# Altium schematic sheet Connectors.SchDoc
size A4; SheetNumber: 1; SheetTotal: 7
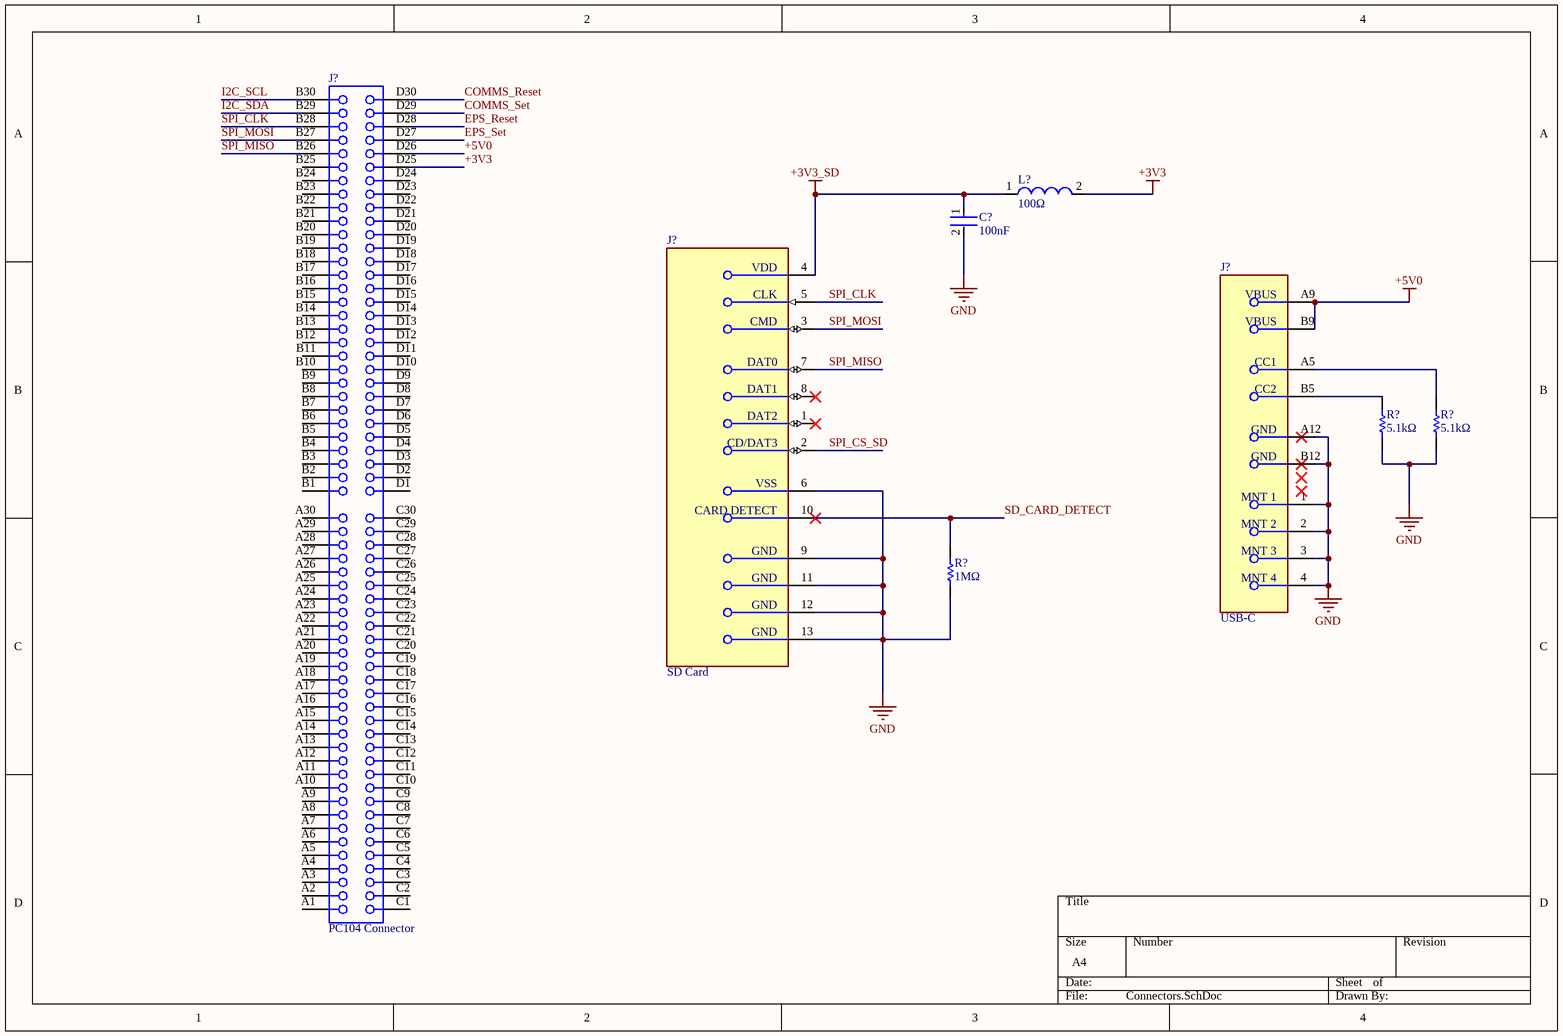
[diagram p0: Connectors.SchDoc]

## Parts
(Parts that share a designator on the sheet are numbered #1, #2 ... from top to bottom, then left to right.)
C?  100nF  [FP-CGA3E-0_3-0_1-IPC_A]
J?#1  SD Card  [FP-DM3CS-SF-MFG]
J?#2  USB-C  [FP-USB4125-GF-A-0190-MFG]
J?#3  PC104 Connector  [BTB2-V120F-04]
L?  100Ω  [SMD-0402]
R?#1  5.1kΩ  [RESC0603X26X15NL03T05]
R?#2  5.1kΩ  [RESC0603X26X15NL03T05]
R?#3  1MΩ  [RESC1005X40X25NL05T10]

## Nets
+3V3: J?#3.D25 L?.2
+3V3_SD: C?.1 J?#1.4(VDD) L?.1
+5V0: J?#2.A9(VBUS) J?#2.B9(VBUS) J?#3.D26
GND: C?.2 J?#1.6(VSS) J?#1.9(GND) J?#1.11(GND) J?#1.12(GND) J?#1.13(GND) J?#2.1(MNT_1) J?#2.2(MNT_2) J?#2.3(MNT_3) J?#2.4(MNT_4) J?#2.A12(GND) J?#2.B12(GND) R?#1.1 R?#2.1 R?#3.2
COMMS_Reset: J?#3.D30
COMMS_Set: J?#3.D29
EPS_Reset: J?#3.D28
EPS_Set: J?#3.D27
I2C_SCL: J?#3.B30
I2C_SDA: J?#3.B29
SD_CARD_DETECT: J?#1.10(CARD_DETECT) R?#3.1
SPI_CLK: J?#1.5(CLK) J?#3.B28
SPI_CS_SD: J?#1.2(CD/DAT3)
SPI_MISO: J?#1.7(DAT0) J?#3.B26
SPI_MOSI: J?#1.3(CMD) J?#3.B27
NetJ?#2_A5: J?#2.A5(CC1) R?#2.2
NetJ?#2_B5: J?#2.B5(CC2) R?#1.2

Not connected (* = marked no-connect by the designer): J?#1 1(DAT2)* 8(DAT1)*; J?#3 A1 A2 A3 A4 A5 A6 A7 A8 A9 A10 A11 A12 A13 A14 A15 A16 A17 A18 A19 A20 A21 A22 A23 A24 A25 A26 A27 A28 A29 A30 B1 B2 B3 B4 B5 B6 B7 B8 B9 B10 B11 B12 B13 B14 B15 B16 B17 B18 B19 B20 B21 B22 B23 B24 B25 C1 C2 C3 C4 C5 C6 C7 C8 C9 C10 C11 C12 C13 C14 C15 C16 C17 C18 C19 C20 C21 C22 C23 C24 C25 C26 C27 C28 C29 C30 D1 D2 D3 D4 D5 D6 D7 D8 D9 D10 D11 D12 D13 D14 D15 D16 D17 D18 D19 D20 D21 D22 D23 D24

## Library data of the parts
C? = CMP-2000-07546-2: Cap Ceramic 100nF 50V X7R 10% Pad SMD 0603 +125°C Automotive T/R; Weight: 7.1E-05oz; Composition: Ceramic; Max Operating Temperature: 125°C; Termination: SMD/SMT; Dielectric: X7R; Length: 1.6mm; Package Quantity: 1; REACH SVHC: No SVHC; Lead Free: Lead Free; Case Code (Metric): 1608; Min Operating Temperature: -55°C; Packaging: Tape and Reel; Tolerance: 10%; Voltage Rating: 50V; Case Code (Imperial): 0603; Capacitance: 100nF; Case/Package: 0603; Voltage Rating (DC): 50V; Depth: 0.8mm; Radiation Hardening: No; Ratings: AEC-Q200; Mount: Surface Mount; Voltage: 50V; Thickness: 0.035inch; Width: 0.8mm; Height: 0.8mm
J?#1 = CMP-11597-000003-1: CONN MICRO SD CARD HINGED TYPE; Pitch: 1.1mm; Connector Type: Connector; Current Rating: 500mA; Voltage Rating (AC): 125V; Gender: Female; Insulation Resistance: 1GR; Number of Positions: 8; Contact Resistance: 100mR; Packaging: Tape and Reel; Flammability Rating: UL94 V-0; Lead Free: Lead Free; Min Operating Temperature: -25°C; Orientation: Right Angle; Width: 13.8mm; Number of Rows: 1; Housing Material: Polymer; Package Quantity: 1; Mount: Surface Mount; Max Current Rating: 500mA; Radiation Hardening: No; Max Operating Temperature: 85°C; Contact Plating: Gold; Depth: 1.83mm; Contact Material: Gold; Length: 14.1mm; Number of Contacts: 8; Termination: Solder
J?#2 = CMP-245163-000004-1: CONN RCPT TYPE C 6P SMD RA
J?#3 = CMP-0001-00103-1: Board-to-Board Connector, PCI104, Self-Nesting Socket, Stackthrough, Vertical, 4-Row, Pitch 2mm, 120-Position, Stack 15.24mm, Receptacle; Component Kind: Standard; ClassName: Board Template Connector; Package Reference: BTB2-V120F-04; Publisher: Altium
L? = CMP-0220-00104-1: SMD EMI Suppression Ferrite Bead WE-CBF, Z = 100 Ohm; Impedance: 100 Ohm; DatasheetVersion: ver 1, Jul-2009; PackageReference: SMD-0402; ComponentLink2URL: http://www.we-online.de/katalog/media/pdf/742792711.pdf; PackageVersion: 2009; PackageDescription: Chip Inductor, 2-Leads, Body 1.0 x 0.5 mm; ComponentLink1Description: Manufacturer Link; ComponentLink1URL: http://www.we-online.com; ComponentLink2Description: Datasheet
R?#1 R?#2 = CMP-2004-02525-1: Part Number: MCRE000157; Manufacturer: Multicomp
R?#3 = CMP-2002-07490-1: Manufacturer: Yageo / Phycomp; Part Number: RC0402FR-071ML